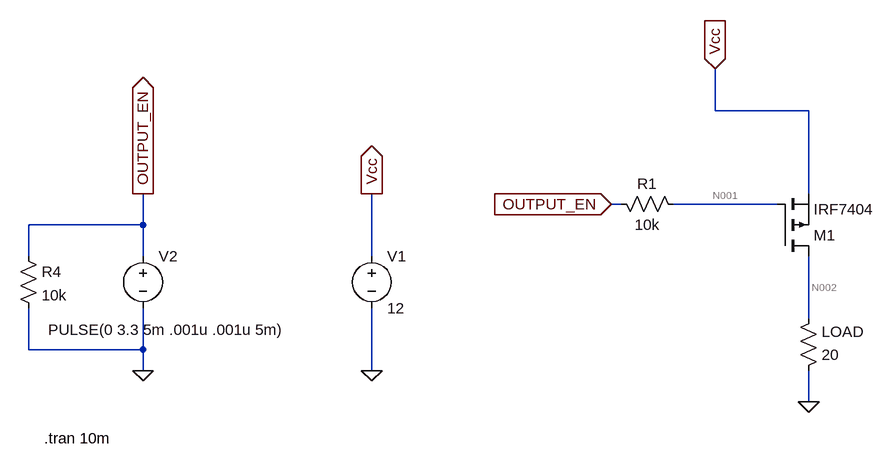
[diagram p0: schematic trying_estop.asc]
trying_estop.asc, the LTspice schematic file:
Version 4
SHEET 1 880 680
WIRE 496 -144 496 -208
WIRE 640 -144 496 -144
WIRE 640 -16 640 -144
WIRE 352 0 336 0
WIRE 592 0 432 0
WIRE -384 32 -384 -16
WIRE -384 32 -560 32
WIRE -560 80 -560 32
WIRE -384 80 -384 32
WIRE -32 80 -32 -16
WIRE 640 176 640 80
WIRE -560 224 -560 160
WIRE -384 224 -384 160
WIRE -384 224 -560 224
WIRE -384 256 -384 224
WIRE -32 256 -32 160
WIRE 640 304 640 256
FLAG -384 256 0
FLAG -384 -16 OUTPUT_EN
IOPIN -384 -16 Out
FLAG -32 256 0
FLAG -32 -16 Vcc
IOPIN -32 -16 Out
FLAG 496 -208 Vcc
IOPIN 496 -208 In
FLAG 336 0 OUTPUT_EN
IOPIN 336 0 In
FLAG 640 304 0
SYMBOL voltage -32 64 R0
WINDOW 123 0 0 Left 0
WINDOW 39 0 0 Left 0
SYMATTR InstName V1
SYMATTR Value 12
SYMBOL res 336 -16 M90
WINDOW 0 0 56 VBottom 2
WINDOW 3 32 56 VTop 2
SYMATTR InstName R1
SYMATTR Value 10k
SYMBOL res 624 272 M180
WINDOW 0 36 76 Left 2
WINDOW 3 36 40 Left 2
SYMATTR InstName LOAD
SYMATTR Value 20
SYMBOL pmos 592 80 M180
SYMATTR InstName M1
SYMATTR Value IRF7404
SYMBOL voltage -384 64 R0
WINDOW 3 -146 129 Left 2
WINDOW 123 0 0 Left 0
WINDOW 39 0 0 Left 0
SYMATTR Value PULSE(0 3.3 5m .001u .001u 5m)
SYMATTR InstName V2
SYMBOL res -576 64 R0
SYMATTR InstName R4
SYMATTR Value 10k
TEXT -536 360 Left 2 !.tran 10m

The netlist it stands for:
* trying_estop.asc
V1 Vcc 0 12
R1 OUTPUT_EN N001 10k
R§LOAD 0 N002 20
M1 N002 N001 Vcc Vcc IRF7404
V2 OUTPUT_EN 0 PULSE(0 3.3 5m .001u .001u 5m)
R4 OUTPUT_EN 0 10k
.model NMOS NMOS
.model PMOS PMOS
.lib standard.mos
.tran 10m
.backanno
.end

* Results of the author's LTspice run, read from the files saved beside the schematic
* Operating Point, zero values left out:
*   V(vcc) = 12 V
*   V(n002) = 11.98 V
*   Id(M1) = -599.1 mA
*   Is(M1) = 599.1 mA
*   I(Load) = -599.1 mA
*   I(V1) = -599.1 mA
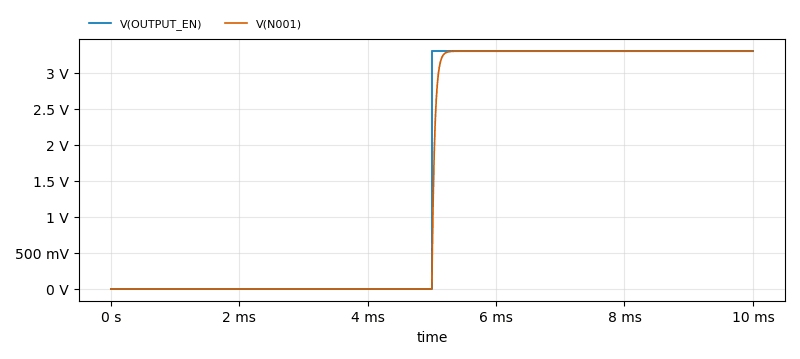
[diagram p1: Transient Analysis of trying_estop.asc, plotted from the saved traces]
* Transient Analysis, 1 run:
*   V(OUTPUT_EN): min 0 V, max 3.3 V, average 1.65 V, rms 2.333 V, last 3.3 V
*   V(N001): min 0 V, max 3.3 V, average 1.636 V, rms 2.318 V, last 3.3 V